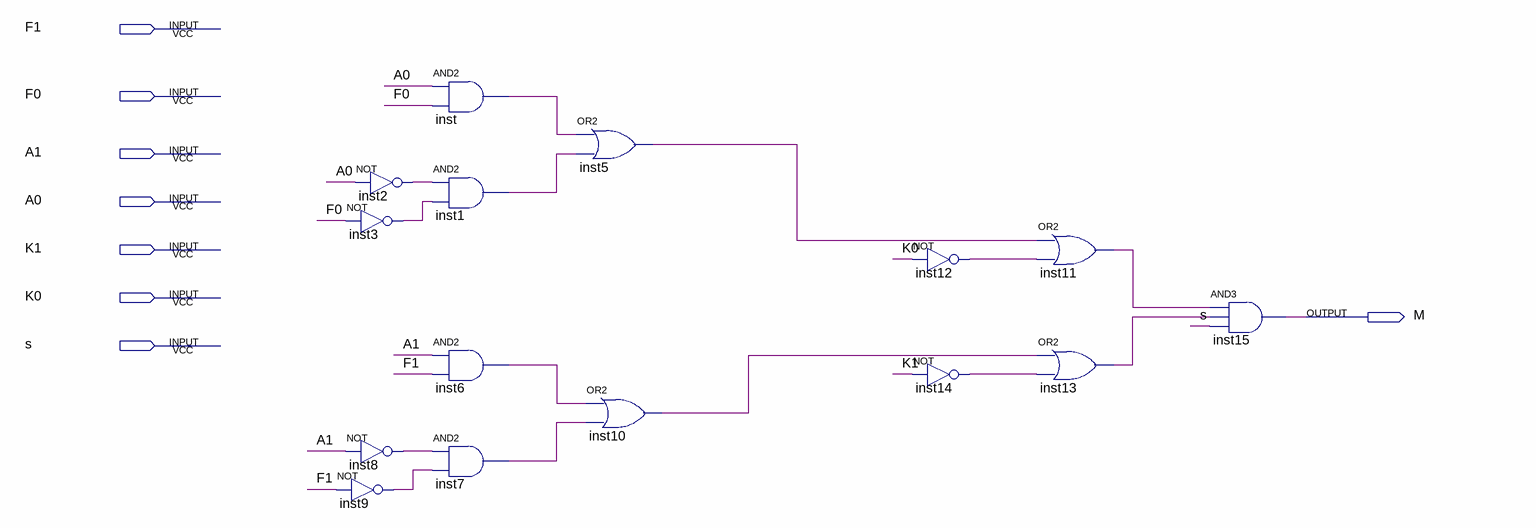
[diagram p0: schematic sheet]
// Quartus schematic eslesmeDevresi.bdf as structural Verilog: 15 symbols, 8 pins
module eslesmeDevresi (
  input  F1,
  input  F0,
  input  A1,
  input  A0,
  input  K1,
  input  K0,
  input  s,
  output M
);

  wire inst1_out, inst2_out, inst3_out, inst5_out, inst6_out, inst7_out, inst8_out, inst9_out, inst10_out,
       inst11_out, inst12_out, inst13_out, inst14_out, inst_out;

  not inst2 (inst2_out, A0);
  not inst3 (inst3_out, F0);
  not inst8 (inst8_out, A1);
  not inst9 (inst9_out, F1);
  and inst (inst_out, A0, F0);
  and inst1 (inst1_out, inst2_out, inst3_out);
  and inst6 (inst6_out, A1, F1);
  and inst7 (inst7_out, inst8_out, inst9_out);
  or inst5 (inst5_out, inst_out, inst1_out);
  or inst10 (inst10_out, inst6_out, inst7_out);
  not inst12 (inst12_out, K0);
  not inst14 (inst14_out, K1);
  or inst11 (inst11_out, inst5_out, inst12_out);
  or inst13 (inst13_out, inst10_out, inst14_out);
  and inst15 (M, inst11_out, inst13_out, s);
endmodule
